# EAGLE design Analog_CAN_Board (EAGLE 8.4.3)
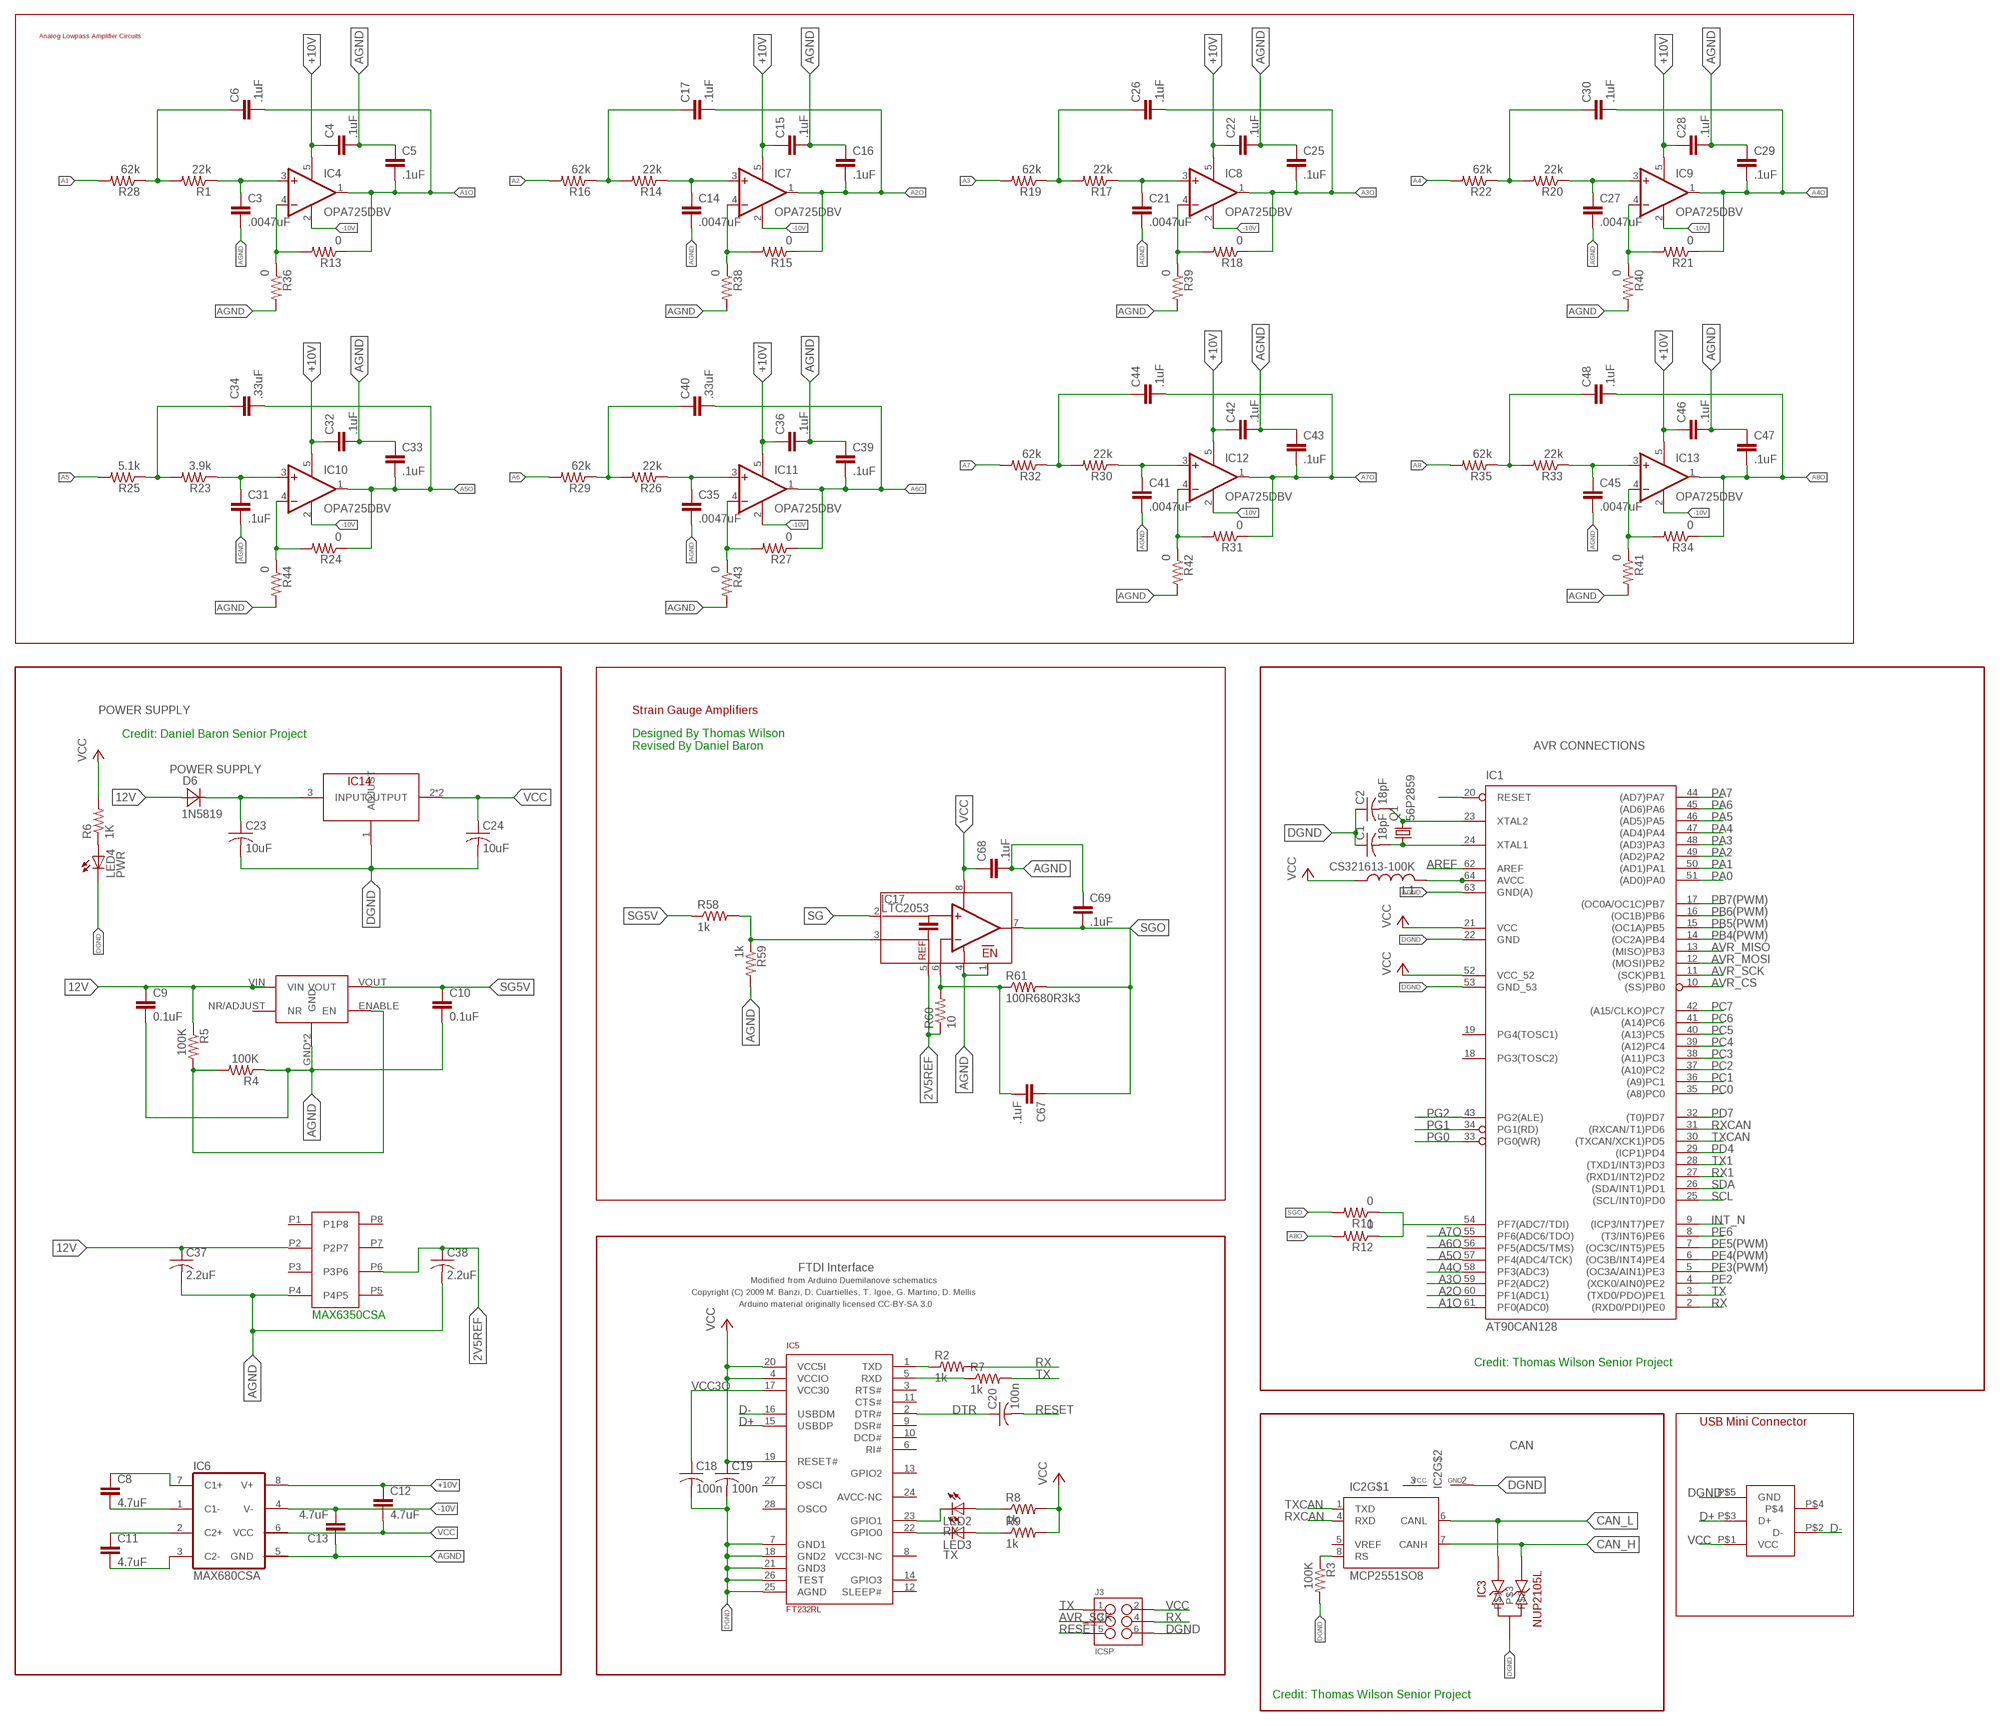
[diagram p0: schematic, sheet 1, part 1 of 2]
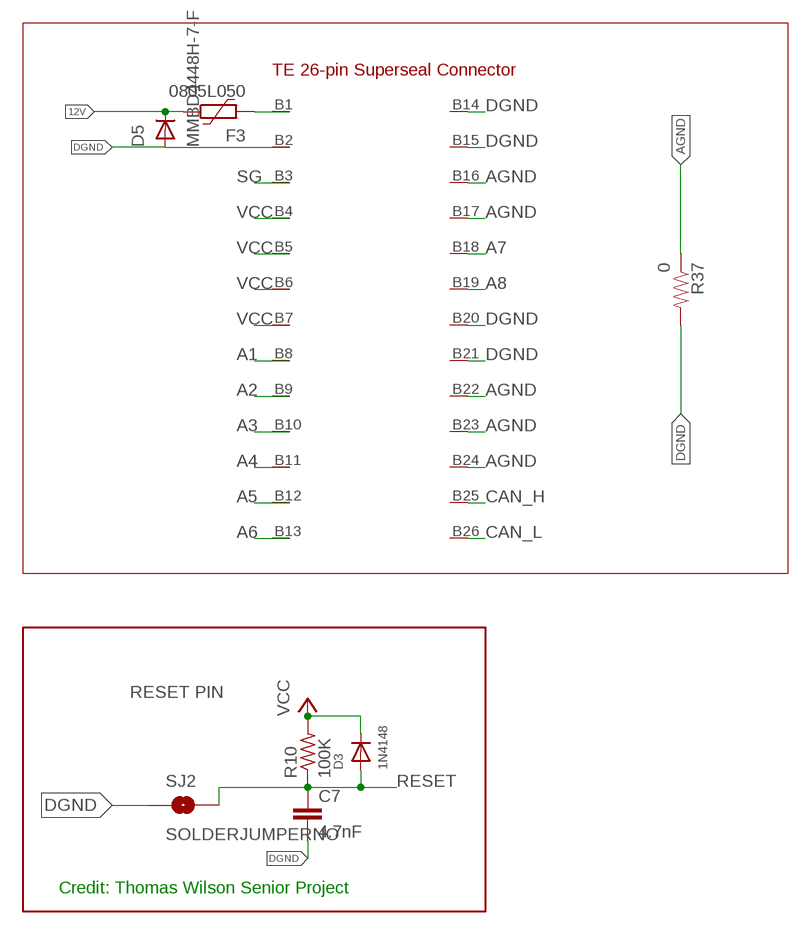
[diagram p1: schematic, sheet 1, part 2 of 2]

## Parts
C1  18pF  C-USC0805  [C0805]
C2  18pF  C-USC0805  [C0805]
C3  .0047uF  CAP0603-CAP  [0603-CAP]
C4  .1uF  CAP0603-CAP  [0603-CAP]
C5  .1uF  CAP0603-CAP  [0603-CAP]
C6  .1uF  CAP0603-CAP  [0603-CAP]
C7  4.7nF  CAP0603-CAP  [0603-CAP]
C8  4.7uF  CAP0603-CAP  [0603-CAP]
C9  0.1uF  C-EUC0603  [C0603]
C10  0.1uF  C-EUC0603  [C0603]
C11  4.7uF  CAP0603-CAP  [0603-CAP]
C12  4.7uF  CAP0603-CAP  [0603-CAP]
C13  4.7uF  CAP0603-CAP  [0603-CAP]
C14  .0047uF  CAP0603-CAP  [0603-CAP]
C15  .1uF  CAP0603-CAP  [0603-CAP]
C16  .1uF  CAP0603-CAP  [0603-CAP]
C17  .1uF  CAP0603-CAP  [0603-CAP]
C18  100n  C-USC0805  [C0805]
C19  100n  C-USC0805  [C0805]
C20  100n  C-USC0805  [C0805]
C21  .0047uF  CAP0603-CAP  [0603-CAP]
C22  .1uF  CAP0603-CAP  [0603-CAP]
C23  10uF  C-USC0603  [C0603]
C24  10uF  C-USC0603  [C0603]
C25  .1uF  CAP0603-CAP  [0603-CAP]
C26  .1uF  CAP0603-CAP  [0603-CAP]
C27  .0047uF  CAP0603-CAP  [0603-CAP]
C28  .1uF  CAP0603-CAP  [0603-CAP]
C29  .1uF  CAP0603-CAP  [0603-CAP]
C30  .1uF  CAP0603-CAP  [0603-CAP]
C31  .1uF  CAP0603-CAP  [0603-CAP]
C32  .1uF  CAP0603-CAP  [0603-CAP]
C33  .1uF  CAP0603-CAP  [0603-CAP]
C34  .33uF  CAP0603-CAP  [0603-CAP]
C35  .0047uF  CAP0603-CAP  [0603-CAP]
C36  .1uF  CAP0603-CAP  [0603-CAP]
C37  2.2uF  C-USC0603  [C0603]
C38  2.2uF  C-USC0603  [C0603]
C39  .1uF  CAP0603-CAP  [0603-CAP]
C40  .33uF  CAP0603-CAP  [0603-CAP]
C41  .0047uF  CAP0603-CAP  [0603-CAP]
C42  .1uF  CAP0603-CAP  [0603-CAP]
C43  .1uF  CAP0603-CAP  [0603-CAP]
C44  .1uF  CAP0603-CAP  [0603-CAP]
C45  .0047uF  CAP0603-CAP  [0603-CAP]
C46  .1uF  CAP0603-CAP  [0603-CAP]
C47  .1uF  CAP0603-CAP  [0603-CAP]
C48  .1uF  CAP0603-CAP  [0603-CAP]
C67  .1uF  CAP0603-CAP  [0603-CAP]
C68  .1uF  CAP0603-CAP  [0603-CAP]
C69  .1uF  CAP0603-CAP  [0603-CAP]
D3  1N4148  DIODESOD-123  [SOD-123]
D5  MMBD4448H-7-F  [SOT23-3]
D6  1N5819  [1N5819SM]
F3  0805L050  [0805L]
IC1  AT90CAN128  [TQFP64]
IC2  MCP2551SO8  [SO08]
IC3  NUP2105L  [SOT-23]
IC4  OPA725DBV  [SOT23-5]
IC5  FT232RL  [SSOP28]
IC6  MAX680CSA  [SO08]
IC7  OPA725DBV  [SOT23-5]
IC8  OPA725DBV  [SOT23-5]
IC9  OPA725DBV  [SOT23-5]
IC10  OPA725DBV  [SOT23-5]
IC11  OPA725DBV  [SOT23-5]
IC12  OPA725DBV  [SOT23-5]
IC13  OPA725DBV  [SOT23-5]
IC14  NCP1117  [SOT-223-4]
IC15  IC15  REG-104GA-5  [REG104GA-5]
IC16  MAX6350CSA  [8-SOIC]
IC17  LTC2053  [MSOP8]
J1  1734753-1_MINIUSB_CON  [1734753-1_MINIUSB_CON]
J2  SUPERSEAL1.0_26POS  [SUPERSEAL1.0_26POS]
J3  ICSP  M03X2SMD_FCI  [2X3_SMD_FCI_54202-G30]
L1  CS321613-100K  L-USL3216C  [L3216C]
LED2  RX  LEDCHIPLED_0805  [CHIPLED_0805]
LED3  TX  LEDCHIPLED_0805  [CHIPLED_0805]
LED4  PWR  LEDCHIPLED_0805  [CHIPLED_0805]
Q1  56P2859  CRYSTALSMD  [HC49UP]
R1  22k  RESISTOR0603  [0603-RES]
R2  1k  R-US_R0805  [R0805]
R3  100K  R-US_R0805  [R0805]
R4  100K  R-US_M0805  [M0805]
R5  100K  R-US_M0805  [M0805]
R6  1K  R-US_R0805  [R0805]
R7  1k  R-US_R0805  [R0805]
R8  1k  R-US_R0805  [R0805]
R9  1k  R-US_R0805  [R0805]
R10  100K  R-US_R0805  [R0805]
R11  0  RESISTOR0603  [0603-RES]
R12  0  RESISTOR0603  [0603-RES]
R13  0  RESISTOR0603  [0603-RES]
R14  22k  RESISTOR0603  [0603-RES]
R15  0  RESISTOR0603  [0603-RES]
R16  62k  RESISTOR0603  [0603-RES]
R17  22k  RESISTOR0603  [0603-RES]
R18  0  RESISTOR0603  [0603-RES]
R19  62k  RESISTOR0603  [0603-RES]
R20  22k  RESISTOR0603  [0603-RES]
R21  0  RESISTOR0603  [0603-RES]
R22  62k  RESISTOR0603  [0603-RES]
R23  3.9k  RESISTOR0603  [0603-RES]
R24  0  RESISTOR0603  [0603-RES]
R25  5.1k  RESISTOR0603  [0603-RES]
R26  22k  RESISTOR0603  [0603-RES]
R27  0  RESISTOR0603  [0603-RES]
R28  62k  RESISTOR0603  [0603-RES]
R29  62k  RESISTOR0603  [0603-RES]
R30  22k  RESISTOR0603  [0603-RES]
R31  0  RESISTOR0603  [0603-RES]
R32  62k  RESISTOR0603  [0603-RES]
R33  22k  RESISTOR0603  [0603-RES]
R34  0  RESISTOR0603  [0603-RES]
R35  62k  RESISTOR0603  [0603-RES]
R36  0  RESISTOR0603  [0603-RES]
R37  0  RESISTOR0603  [0603-RES]
R38  0  RESISTOR0603  [0603-RES]
R39  0  RESISTOR0603  [0603-RES]
R40  0  RESISTOR0603  [0603-RES]
R41  0  RESISTOR0603  [0603-RES]
R42  0  RESISTOR0603  [0603-RES]
R43  0  RESISTOR0603  [0603-RES]
R44  0  RESISTOR0603  [0603-RES]
R58  1k  RESISTOR0603  [0603-RES]
R59  1k  RESISTOR0603  [0603-RES]
R60  10  RESISTOR0603  [0603-RES]
R61  100R680R3k3  RESISTOR0603  [0603-RES]
SJ2  SOLDERJUMPERNO  [SJ_2S-NO]

## Nets
2V5REF: C38.1 IC16.P6 IC17.5(REF) R60.1
5V_REG_IN: C23.1 D6.P$2(C) IC14.3(INPUT)
12V: C9.1 C37.1 D5.3(C) D6.P$1(A) F3.1 IC15.VIN IC16.P2 R5.1
+10V: C4.1 C12.1 C15.1 C22.1 C28.1 C32.1 C36.1 C42.1 C46.1 IC4.5(V+) IC6.8(V+) IC7.5(V+) IC8.5(V+) IC9.5(V+) IC10.5(V+) IC11.5(V+) IC12.5(V+) IC13.5(V+)
-10V: C13.2 IC4.2(V-) IC6.4(V-) IC7.2(V-) IC8.2(V-) IC9.2(V-) IC10.2(V-) IC11.2(V-) IC12.2(V-) IC13.2(V-)
A1: J2.B8 R28.2
A1O: C5.2 C6.2 IC1.61(PF0(ADC0)) IC4.1(OUT) R13.1
A2: J2.B9 R16.2
A2O: C16.2 C17.2 IC1.60(PF1(ADC1)) IC7.1(OUT) R15.1
A3: J2.B10 R19.2
A3O: C25.2 C26.2 IC1.59(PF2(ADC2)) IC8.1(OUT) R18.1
A4: J2.B11 R22.2
A4O: C29.2 C30.2 IC1.58(PF3(ADC3)) IC9.1(OUT) R21.1
A5: J2.B12 R25.2
A5O: C33.2 C34.2 IC1.57(PF4(ADC4/TCK)) IC10.1(OUT) R24.1
A6: J2.B13 R29.2
A6O: C39.2 C40.2 IC1.56(PF5(ADC5/TMS)) IC11.1(OUT) R27.1
A7: J2.B18 R32.2
A7O: C43.2 C44.2 IC1.55(PF6(ADC6/TDO)) IC12.1(OUT) R31.1
A8: J2.B19 R35.2
A8O: C47.2 C48.2 IC13.1(OUT) R12.2 R34.1
AGND: C3.2 C4.2 C5.1 C9.2 C10.2 C13.1 C14.2 C15.2 C16.1 C21.2 C22.2 C25.1 C27.2 C28.2 C29.1 C31.2 C32.2 C33.1 C35.2 C36.2 C37.2 C38.2 C39.1 C41.2 C42.2 C43.1 C45.2 C46.2 C47.1 C68.2 C69.1 IC1.63(GND(A)) IC6.5(GND) IC15.GND IC15.HEATGND(GND) IC16.P4 IC17.1(EN) IC17.4(V-) J2.B16 J2.B17 J2.B22 J2.B23 J2.B24 R4.1 R36.2 R37.1 R38.2 R39.2 R40.2 R41.2 R42.2 R43.2 R44.2 R59.2
AREF: IC1.62(AREF)
AVR_CS: IC1.10((SS)PB0)
AVR_MISO: IC1.13((MISO)PB3)
AVR_MOSI: IC1.12((MOSI)PB2)
AVR_SCK: IC1.11((SCK)PB1) J3.3
CAN_H: IC2.7(CANH) IC3.2 J2.B25
CAN_L: IC2.6(CANL) IC3.1 J2.B26
D+: IC5.15(USBDP) J1.P$3(D+)
D-: IC5.16(USBDM) J1.P$2(D-)
DGND: C1.1 C2.1 C7.2 C18.2 C19.2 C23.2 C24.2 D5.1(A) IC1.22(GND) IC1.53(GND_53) IC2.2(GND) IC3.3 IC5.7(GND1) IC5.18(GND2) IC5.21(GND3) IC5.25(AGND) IC5.26(TEST) IC14.1(ADJUST) J1.P$5(GND) J2.B2 J2.B14 J2.B15 J2.B20 J2.B21 J3.6 LED4.C R3.2 R37.2 SJ2.1
DTR: C20.1 IC5.2(DTR#)
INT_N: IC1.9((ICP3/INT7)PE7)
M8RXD: IC5.1(TXD) R2.1
M8TXD: IC5.5(RXD) R7.1
N$1: F3.2 J2.B1
N$2: IC15.ENABLE(EN) R4.2 R5.2
N$5: C6.1 R1.2 R28.1
N$6: IC2.8(RS) R3.1
N$9: LED4.A R6.1
N$11: C1.2 IC1.24(XTAL1) Q1.1
N$17: C3.1 IC4.3(+IN) R1.1
N$18: IC1.54(PF7(ADC7/TDI)) R11.1 R12.1
N$19: IC4.4(-IN) R13.2 R36.1
N$20: C8.1 IC6.7(C1+)
N$21: C11.1 IC6.2(C2+)
N$22: IC1.64(AVCC) L1.2
N$23: C8.2 IC6.1(C1-)
N$24: C11.2 IC6.3(C2-)
N$25: C14.1 IC7.3(+IN) R14.1
N$26: IC7.4(-IN) R15.2 R38.1
N$27: C17.1 R14.2 R16.1
N$28: IC17.3(+IN) R58.2 R59.1
N$29: C67.2 IC17.6(RG) R60.2 R61.1
N$30: C21.1 IC8.3(+IN) R17.1
N$31: IC8.4(-IN) R18.2 R39.1
N$32: IC5.23(GPIO1) LED2.C
N$33: C26.1 R17.2 R19.1
N$34: IC5.22(GPIO0) LED3.C
N$35: LED2.A R8.1
N$36: LED3.A R9.1
N$37: C27.1 IC9.3(+IN) R20.1
N$38: IC9.4(-IN) R21.2 R40.1
N$39: C30.1 R20.2 R22.1
N$40: C31.1 IC10.3(+IN) R23.1
N$41: IC10.4(-IN) R24.2 R44.1
N$42: C34.1 R23.2 R25.1
N$43: C35.1 IC11.3(+IN) R26.1
N$44: IC11.4(-IN) R27.2 R43.1
N$45: C40.1 R26.2 R29.1
N$46: C41.1 IC12.3(+IN) R30.1
N$47: IC12.4(-IN) R31.2 R42.1
N$48: C44.1 R30.2 R32.1
N$49: C45.1 IC13.3(+IN) R33.1
N$50: IC13.4(-IN) R34.2 R41.1
N$51: C48.1 R33.2 R35.1
PA0: IC1.51((AD0)PA0)
PA1: IC1.50((AD1)PA1)
PA2: IC1.49((AD2)PA2)
PA3: IC1.48((AD3)PA3)
PA4: IC1.47((AD4)PA4)
PA5: IC1.46((AD5)PA5)
PA6: IC1.45((AD6)PA6)
PA7: IC1.44((AD7)PA7)
PB4(PWM): IC1.14((OC2A)PB4)
PB5(PWM): IC1.15((OC1A)PB5)
PB6(PWM): IC1.16((OC1B)PB6)
PB7(PWM): IC1.17((OC0A/OC1C)PB7)
PC0: IC1.35((A8)PC0)
PC1: IC1.36((A9)PC1)
PC2: IC1.37((A10)PC2)
PC3: IC1.38((A11)PC3)
PC4: IC1.39((A12)PC4)
PC5: IC1.40((A13)PC5)
PC6: IC1.41((A14)PC6)
PC7: IC1.42((A15/CLKO)PC7)
PD4: IC1.29((ICP1)PD4)
PD7: IC1.32((T0)PD7)
PE2: IC1.4((XCK0/AIN0)PE2)
PE3(PWM): IC1.5((OC3A/AIN1)PE3)
PE4(PWM): IC1.6((OC3B/INT4)PE4)
PE5(PWM): IC1.7((OC3C/INT5)PE5)
PE6: IC1.8((T3/INT6)PE6)
PG0: IC1.33(PG0(WR))
PG1: IC1.34(PG1(RD))
PG2: IC1.43(PG2(ALE))
RESET: C7.1 C20.2 D3.A IC1.20(RESET) J3.5 R10.1 SJ2.2
RX: IC1.2((RXD0/PDI)PE0) J3.4 R2.2
RX1: IC1.27((RXD1/INT2)PD2)
RXCAN: IC1.31((RXCAN/T1)PD6) IC2.4(RXD)
SCL: IC1.25((SCL/INT0)PD0)
SDA: IC1.26((SDA/INT1)PD1)
SG: IC17.2(-IN) J2.B3
SG5V: C10.1 IC15.VOUT R58.1
SGO: C67.1 C69.2 IC17.7(OUT) R11.2 R61.2
TX: IC1.3((TXD0/PDO)PE1) J3.1 R7.2
TX1: IC1.28((TXD1/INT3)PD3)
TXCAN: IC1.30((TXCAN/XCK1)PD5) IC2.1(TXD)
VCC: C12.2 C19.1 C24.1 C68.1 D3.C IC1.21(VCC) IC1.52(VCC_52) IC5.4(VCCIO) IC5.19(RESET#) IC5.20(VCC5I) IC6.6(VCC) IC14.2(OUTPUT) IC14.4(OUTPUT) IC17.8(V+) J1.P$1(VCC) J2.B4 J2.B5 J2.B6 J2.B7 J3.2 L1.1 R6.2 R8.2 R9.2 R10.2
VCC3O: C18.1 IC5.17(VCC30)
XTAL1: C2.2 IC1.23(XTAL2) Q1.2
Unconnected: IC1.18(PG3(TOSC2)) IC1.19(PG4(TOSC1)) IC2.5(VREF) IC5.3(RTS#) IC5.6(RI#) IC5.8(VCC3I-NC) IC5.9(DSR#) IC5.10(DCD#) IC5.11(CTS#) IC5.12(SLEEP#) IC5.13(GPIO2) IC5.14(GPIO3) IC5.24(AVCC-NC) IC5.27(OSCI) IC5.28(OSCO) IC15.NR/ADJUST(NR) IC16.P1 IC16.P3 IC16.P5 IC16.P7 IC16.P8 J1.P$4

## Notes on the sheet
- Analog Lowpass Amplifier Circuits
- TE 26-pin Superseal Connector
- POWER SUPPLY | Strain Gauge Amplifiers
- Credit: Daniel Baron Senior Project
- Designed By Thomas Wilson
  Revised By Daniel Baron
- AVR CONNECTIONS
- POWER SUPPLY
- RESET PIN
- Credit: Thomas Wilson Senior Project
- FTDI Interface
- Modified from Arduino Duemilanove schematics
- Copyright (C) 2009 M. Banzi, D. Cuartielles, T. Igoe, G. Martino, D. Mellis
- Arduino material originally licensed CC-BY-SA 3.0
- MAX6350CSA
- Credit: Thomas Wilson Senior Project
- USB Mini Connector
- CAN
- Credit: Thomas Wilson Senior Project

## Power pins joined to a net without a drawn wire
VCC: IC2.3(VCC)

## Library data of the parts
C1 C2 C18-C20 C23 C24 C37 C38 = rcl:C-US: CAPACITOR, American symbol
C3-C6 C8 C11-C17 C21 C22 C25-C36 C39-C48 C67-C69 = SparkFun-Passives:CAP: Capacitor Standard 0603 ceramic capacitor, and 0.1" leaded capacitor.
C7 = SparkFun-Capacitors:CAP: Capacitor Standard 0603 ceramic capacitor, and 0.1" leaded capacitor.
C9 C10 = rcl:C-EU: CAPACITOR, European symbol
D3 = adafruit:DIODE: Diode SMADIODE - SMA Surface Mount Package 20V 1A Schottky Diode Digikey: 641-1014-6-ND DO-1N4148 - Through Hole Small Current Diode SOD-123 20V 1 A (.5mV Vf) Schottky Diode - Digikey: MBRX120TPMSCT-ND SOD-323 10V 570mA (.38mV Vf, 3ns) Schottky Diode - Digikey: ZLLS410CT-ND SOD-523 30V 30mA Schottky Diode (RB751S-40TE61) - Digikey: RB751S-40TE61CT-ND SOT23-R/W - SOT23 Package (R = Solder Paste/Reflow Ovens, W = Hand-Soldering) BAT54Film 40V 300mA - Digikey: 497-7162-1-ND
D5 = diodes-inc:MMBD4448H-7-F
D6 = diode:1N5819
F3 = LittleFuse:?: Polyfuse Resettable PTC Source: http://www.littelfuse.com/products/resettable-ptcs.aspx; MF: Littelfuse; MPN: 0805L050; OC_FARNELL: 1832103; OC_NEWARK: 18M4776
IC1 = at90can128:AT90CAN128
IC2 = can:MCP2551: CAN Tranceiver Microchip
IC3 = Artificial Science:NUP2105L
IC4 IC7-IC13 = linear:OPA725: Very Low Noise, High-Speed, 12V CMOS Operational Amplifier Source: http://focus.ti.com/lit/ds/symlink/opa725.pdf
IC5 = SmartPrj:FT232RL
IC6 = maxim:MAX680CSA: Switched-capcitor VOLTAGE CONVERTER; MF: MAXIM; MPN: MAX680CSA; OC_FARNELL: 9725717; OC_NEWARK: 34C3975
IC14 = on-semiconductor:NCP1117
IC15 = DashAndCAN library:REG-104GA-5
IC16 = DashAndCAN library:MAX6350CSA
IC17 = linear-technology:LTC2053: DK: LTC2053CMS8#PBF-ND
J1 = us-te-con:1734753-1_MINIUSB_CON
J2 = TE:SUPERSEAL1.0_26POS
J3 = SparkFun-Connectors:M03X2: 2x3 .1" header. Shrouded, with keying- CONN-10681 SMT- CONN-11415 Pogo pins- HW-11044
L1 = rcl:L-US: INDUCTOR, American symbol
LED2-LED4 = led:LED: LED OSRAM: - CHIPLED LG R971, LG N971, LY N971, LG Q971, LY Q971, LO R971, LY R971 LH N974, LH R974 LS Q976, LO Q976, LY Q976 LO Q996 - Hyper CHIPLED LW Q18S LB Q993, LB Q99A, LB R99A - SideLED LS A670, LO A670, LY A670, LG A670, LP A670 LB A673, LV A673, LT A673, LW A673 LH A674 LY A675 LS A676, LA A676, LO A676, LY A676, LW A676 LS A679, LY A679, LG A679 - Hyper Micro SIDELED® LS Y876, LA Y876, LO Y876, LY Y876 LT Y87S - SmartLED LW L88C, LW L88S LB L89C, LB L89S, LG L890 LS L89K, LO L89K, LY L89K LS L896, LA L896, LO L896, LY L896 - TOPLED LS T670, LO T670, LY T670, LG T670, LP T670 LSG T670, LSP T670, LSY T670, LOP T670, LYG T670 LG T671, LOG T671, LSG T671 LB T673, LV T673, LT T673, LW T673 LH T674 LS T676, LA T676, LO T676, LY T676, LB T676, LH T676, LSB T676, LW T676 LB T67C, LV T67C, LT T67C, LS T67K, LO T67K, LY T67K, LW E67C LS E67B, LA E67B, LO E67B, LY E67B, LB E67C, LV E67C, LT E67C LW T67C LS T679, LY T679, LG T679 LS T770, LO T770, LY T770, LG T770, LP T770 LB T773, LV T773, LT T773, LW T773 LH T774 LS E675, LA E675, LY E675, LS T675 LS T776, LA T776, LO T776, LY T776, LB T776 LHGB T686 LT T68C, LB T68C - Hyper Mini TOPLED® LB M676 - Mini TOPLED Santana® LG M470 LS M47K, LO M47K, LY M47K Source: http://www.osram.convergy.de LUXEON: - LUMILED® LXK2-PW12-R00, LXK2-PW12-S00, LXK2-PW14-U00, LXK2-PW14-V00 LXK2-PM12-R00, LXK2-PM12-S00, LXK2-PM14-U00 LXK2-PE12-Q00, LXK2-PE12-R00, LXK2-PE12-S00, LXK2-PE14-T00, LXK2-PE14-U00 LXK2-PB12-K00, LXK2-PB12-L00, LXK2-PB12-M00, LXK2-PB14-N00, LXK2-PB14-P00, LXK2-PB14-Q00 LXK2-PR12-L00, LXK2-PR12-M00, LXK2-PR14-Q00, LXK2-PR14-R00 LXK2-PD12-Q00, LXK2-PD12-R00, LXK2-PD12-S00 LXK2-PH12-R00, LXK2-PH12-S00 LXK2-PL12-P00, LXK2-PL12-Q00, LXK2-PL12-R00 Source: www.luxeon.com KINGBRIGHT: KA-3528ASYC Source: www.kingbright.com
Q1 = SparkFun-FreqCtrl:CRYSTAL: Various standard crystals. Proven footprints. Spark Fun Electronics SKU : COM-00534
R1 R11-R44 R58-R61 = SparkFun-Resistors:RESISTOR: Resistor Basic schematic elements and footprints for 0603, 1206, and PTH resistors.
R2-R10 = rcl:R-US_: RESISTOR, American symbol
SJ2 = SparkFun-Passives:SOLDERJUMPER: Solder Jumper Standard SMD solder jumper. Used to automate production. Two varients : Normally Open and Normally Closed are the same, but have different paste layers. NC will have a large amount of paste and should jumper during reflow.

## Board
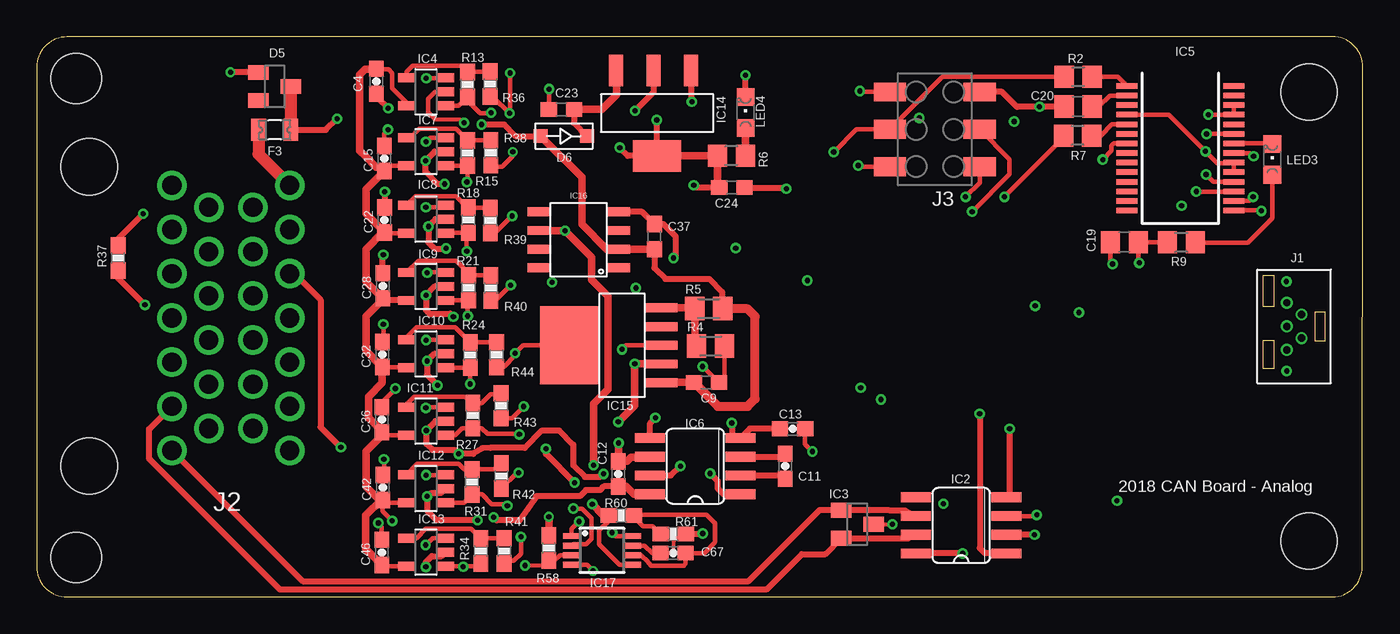
[diagram p2: board, top side]
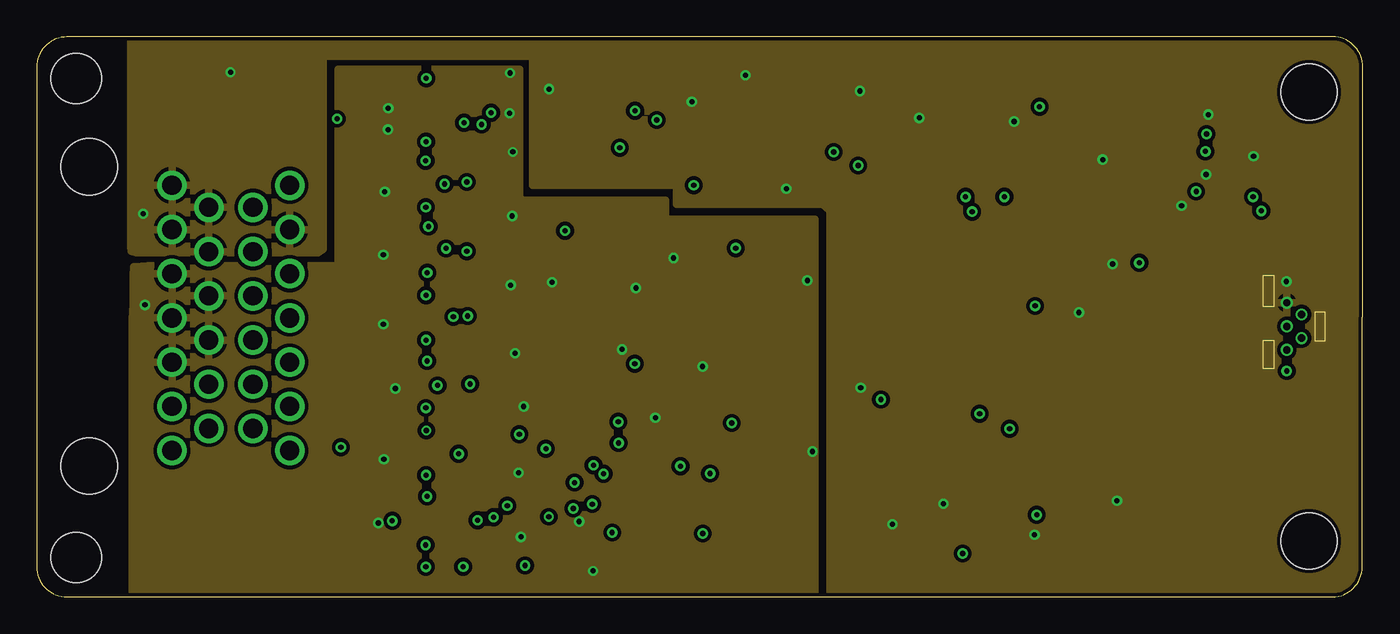
[diagram p3: board, inner layer TopMiddle]
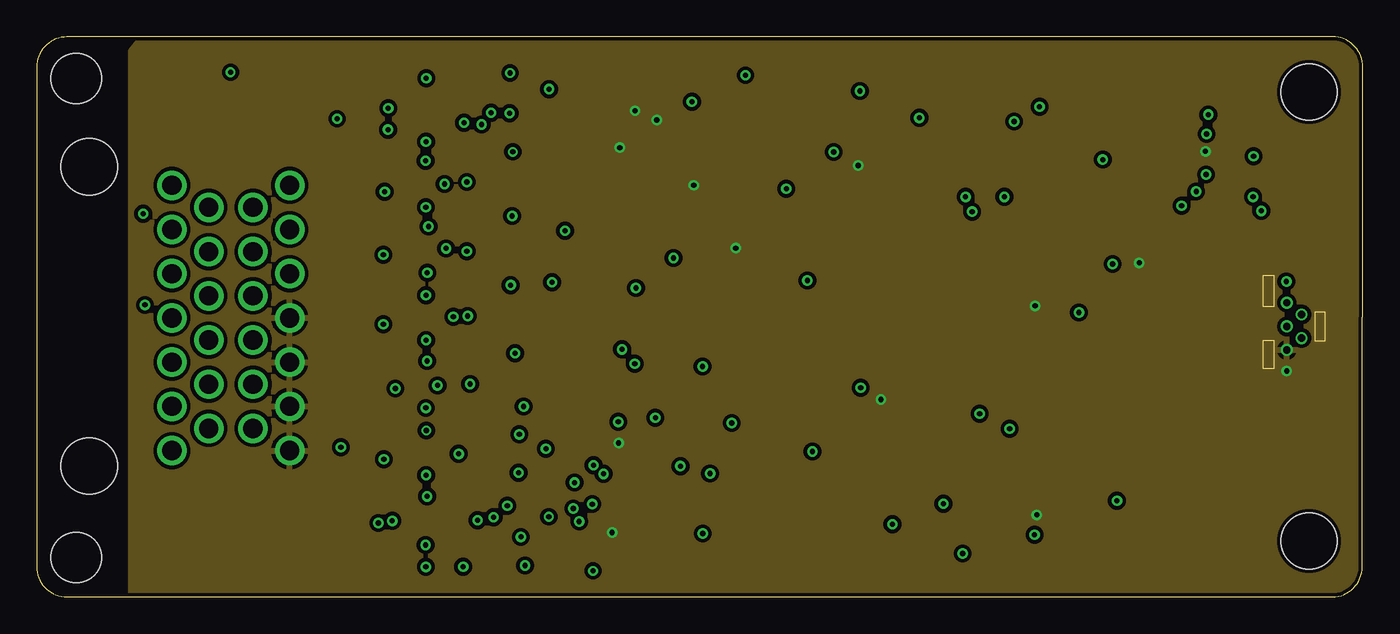
[diagram p4: board, inner layer BottomMiddle]
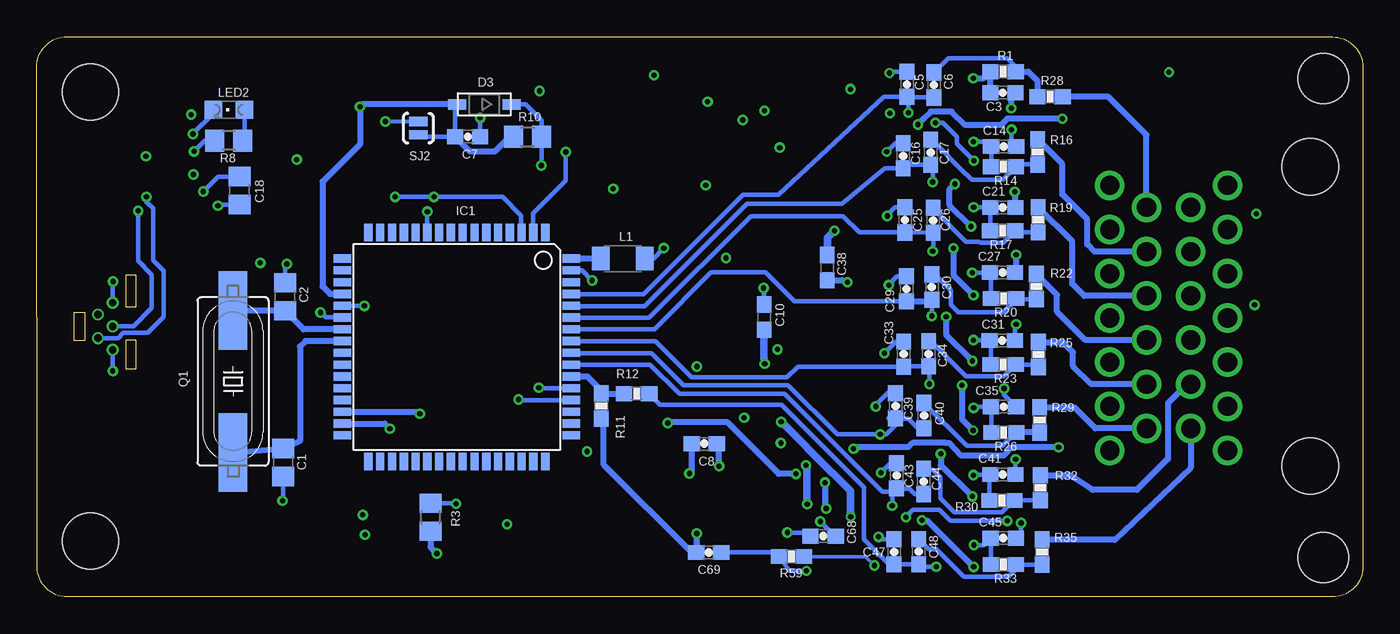
[diagram p5: board, bottom side, seen from below]

Size 90.01 x 38.01 mm. Coordinates in mm from the lower left corner, seen from the top.
Outline: 0,35.97 0,2.03 arc90 2.03,0 87.95,0 arc90 89.98,2.03 90.01,35.98 arc90 87.98,38.01 2.03,38 arc90 0,35.97
Copper layers (1*6*11*16): Top 0.053340625mm / dielectric 7.5mil / TopMiddle 0.035559375mm / dielectric 40mil / BottomMiddle 0.035559375mm / dielectric 7.5mil / Bottom 0.053340625mm
Design rules "default *": minimum track width 10mil, minimum drill 6mil, track to track 6mil, track to pad 0.152653125mm, pad to pad 6mil, via to via 6mil, smd to smd 6mil, copper to edge 10mil, drill to drill 6mil, minimum pad ring 6mil, minimum via ring 6mil, stop-mask expansion 4mil, vias tented up to drill 0mil, thermal gap 10mil
Holes 3.81 mm at 3.56,29.2 3.56,8.88 86.36,34.28 86.36,3.8

### Footprints (pad centres in the part's own frame; a part is rotated, then mirrored left to right if it is on the bottom)
C0805 = smd 1.3 x 1.5: 1 -0.95,0; 2 0.95,0
0603-CAP = smd 1.1 x 1: 1 -0.85,0; 2 0.85,0
C0603 = smd 1.1 x 1: 1 -0.85,0; 2 0.85,0
SOD-123 = smd 1.2 x 0.7: A 1.85,0; C -1.85,0
SOT23-3 = smd 1 x 1.4: 1 -0.95,-1.1; 2 0.95,-1.1; 3 0,1.1
1N5819SM = smd 0.95 x 0.9: P$1 -1.575,0; P$2 1.575,0
0805L = smd 1 x 1.5: 1 -1.1,0; 2 1.1,0
TQFP64 = smd 1.194 x 0.559: 1 -7.76,6; 2 -7.76,5.2; 3 -7.76,4.4; 4 -7.76,3.6; 5 -7.76,2.8; 6 -7.76,2; 7 -7.76,1.2; 8 -7.76,0.4; 9 -7.76,-0.4; 10 -7.76,-1.2; 11 -7.76,-2; 12 -7.76,-2.8; 13 -7.76,-3.6; 14 -7.76,-4.4; 15 -7.76,-5.2; 16 -7.76,-6; 33 7.76,-6; 34 7.76,-5.2; 35 7.76,-4.4; 36 7.76,-3.6; 37 7.76,-2.8; 38 7.76,-2; 39 7.76,-1.2; 40 7.76,-0.4; 41 7.76,0.4; 42 7.76,1.2; 43 7.76,2; 44 7.76,2.8; 45 7.76,3.6; 46 7.76,4.4; 47 7.76,5.2; 48 7.76,6 | smd 0.559 x 1.194: 17 -6,-7.76; 18 -5.2,-7.76; 19 -4.4,-7.76; 20 -3.6,-7.76; 21 -2.8,-7.76; 22 -2,-7.76; 23 -1.2,-7.76; 24 -0.4,-7.76; 25 0.4,-7.76; 26 1.2,-7.76; 27 2,-7.76; 28 2.8,-7.76; 29 3.6,-7.76; 30 4.4,-7.76; 31 5.2,-7.76; 32 6,-7.76; 49 6,7.76; 50 5.2,7.76; 51 4.4,7.76; 52 3.6,7.76; 53 2.8,7.76; 54 2,7.76; 55 1.2,7.76; 56 0.4,7.76; 57 -0.4,7.76; 58 -1.2,7.76; 59 -2,7.76; 60 -2.8,7.76; 61 -3.6,7.76; 62 -4.4,7.76; 63 -5.2,7.76; 64 -6,7.76
SO08 = smd 0.66 x 2.032: 1 -1.905,-3.073; 2 -0.635,-3.073; 3 0.635,-3.073; 4 1.905,-3.073; 5 1.905,3.073; 6 0.635,3.073; 7 -0.635,3.073; 8 -1.905,3.073
SOT-23 = smd 1 x 1.4: 1 -0.95,-1.1; 2 0.95,-1.1; 3 0,1.1
SOT23-5 = smd 0.6 x 1.2: 1 -0.95,-1.306; 2 0,-1.306; 3 0.95,-1.306; 4 0.95,1.306; 5 -0.95,1.306
SSOP28 = smd 0.381 x 1.499: 1 -4.225,-3.625; 2 -3.575,-3.625; 3 -2.925,-3.625; 4 -2.275,-3.625; 5 -1.625,-3.625; 6 -0.975,-3.625; 7 -0.325,-3.625; 8 0.325,-3.625; 9 0.975,-3.625; 10 1.625,-3.625; 11 2.275,-3.625; 12 2.925,-3.625; 13 3.575,-3.625; 14 4.225,-3.625; 15 4.225,3.625; 16 3.575,3.625; 17 2.925,3.625; 18 2.275,3.625; 19 1.625,3.625; 20 0.975,3.625; 21 0.325,3.625; 22 -0.325,3.625; 23 -0.975,3.625; 24 -1.625,3.625; 25 -2.275,3.625; 26 -2.925,3.625; 27 -3.575,3.625; 28 -4.225,3.625
SOT-223-4 = smd 0.95 x 2.15: 1 -2.3,-2.9; 2 0.24,-2.9; 3 2.78,-2.9 | smd 3.25 x 2.15: 4 0,2.9
REG104GA-5 = smd 0.6 x 2.2: ENABLE 2.54,-6.2; GND 0,-6.2; NR/ADJUST 1.27,-6.2; VIN -2.54,-6.2; VOUT -1.27,-6.2 | smd 5.3 x 4: HEATGND 0,0
8-SOIC = smd 0.6 x 1.55: P1 -1.905,-2.7; P2 -0.635,-2.7; P3 0.635,-2.7; P4 1.905,-2.7; P5 1.905,2.7; P6 0.635,2.7; P7 -0.635,2.7; P8 -1.905,2.7
MSOP8 = smd 0.4 x 1.2: 1 -0.975,-2.05; 2 -0.325,-2.05; 3 0.325,-2.05; 4 0.975,-2.05; 5 0.975,2.05; 6 0.325,2.05; 7 -0.325,2.05; 8 -0.975,2.05
1734753-1_MINIUSB_CON = drill 0.5: P$1 -0.5,-1.6; P$2 0.5,-0.8; P$3 -0.5,0; P$4 0.5,0.8; P$5 -0.5,1.6
SUPERSEAL1.0_26POS = drill 1.3 pad 2: B1 -9.17,4.73; B2 -6.17,4.73; B3 -3.17,4.73; B4 -0.17,4.73; B5 2.83,4.73; B6 5.83,4.73; B7 8.83,4.73; B8 -7.67,2.23; B9 -4.67,2.23; B10 -1.67,2.23; B11 1.33,2.23; B12 4.33,2.23; B13 7.33,2.23; B14 -7.67,-0.77; B15 -4.67,-0.77; B16 -1.67,-0.77; B17 1.33,-0.77; B18 4.33,-0.77; B19 7.33,-0.77; B20 -9.17,-3.27; B21 -6.17,-3.27; B22 -3.17,-3.27; B23 -0.17,-3.27; B24 2.83,-3.27; B25 5.83,-3.27; B26 8.83,-3.27 | hole 3.4: -16.42,-9.77; 16.08,-9.77
2X3_SMD_FCI_54202-G30 = smd 1.27 x 2.18: 1 -2.54,-3.05; 2 -2.54,3.05; 3 0,-3.05; 4 0,3.05; 5 2.54,-3.05; 6 2.54,3.05
L3216C = smd 1.2 x 1.6: 1 -1.5,0; 2 1.5,0
CHIPLED_0805 = smd 1.2 x 1.2: A 0,-1.05; C 0,1.05
HC49UP = smd 5.334 x 1.93: 1 -4.826,0; 2 4.826,0
0603-RES = smd 1.1 x 1: 1 -0.85,0; 2 0.85,0
R0805 = smd 1.3 x 1.5: 1 -0.95,0; 2 0.95,0
M0805 = smd 1.3 x 1.6: 1 -0.95,0; 2 0.95,0
SJ_2S-NO = smd 0.635 x 1.27: 1 -0.45,0; 2 0.45,0

### Placement (x,y rotation side)
C1  73.28,9.12 90 bottom
C2  73.16,20.38 270 bottom
C3  24.43,34.21 0 bottom
C4  23.04,34.99 270 top
C5  30.94,34.79 270 bottom
C6  29.11,34.74 270 bottom
C7  60.76,31.23 0 bottom
C8  44.7,10.4 180 bottom
C9  45.46,14.56 0 top
C10  40.63,18.99 90 bottom
C11  50.8,8.88 90 top
C12  39.48,8.35 90 top
C13  51.31,11.42 180 top
C14  24.38,30.56 0 bottom
C15  23.59,29.75 90 top
C16  31.19,29.94 270 bottom
C17  29.32,30.17 270 bottom
C18  76.25,27.58 270 bottom
C19  73.84,24.08 180 top
C20  70.69,33.28 180 top
C21  24.43,26.44 0 bottom
C22  23.61,25.58 90 top
C23  35.61,33.08 180 top
C24  47.18,27.79 0 top
C25  31.08,25.59 270 bottom
C26  29.16,25.56 270 bottom
C27  24.46,22.02 0 bottom
C28  23.48,21.11 90 top
C29  30.97,20.91 270 bottom
C30  29.25,21.02 270 bottom
C31  24.47,17.41 0 bottom
C32  23.45,16.45 90 top
C33  31.16,16.48 270 bottom
C34  29.46,16.5 270 bottom
C35  24.38,12.91 0 bottom
C36  23.43,12.03 90 top
C37  41.93,24.45 90 top
C38  36.35,22.35 270 bottom
C39  31.71,12.97 270 bottom
C40  29.78,12.3 270 bottom
C41  24.43,8.3 0 bottom
C42  23.48,7.43 90 top
C43  31.65,8.23 270 bottom
C44  29.81,7.84 270 bottom
C45  24.4,3.99 0 bottom
C46  23.42,3.02 90 top
C47  31.81,3.06 270 bottom
C48  30.14,3.07 270 bottom
C67  43.2,2.98 0 top
C68  36.63,4.12 0 bottom
C69  44.4,3.02 180 bottom
D3  59.63,33.43 180 bottom
D5  16.15,34.64 270 top
D6  35.78,31.28 0 top
F3  16.15,31.69 180 top
IC1  61.5,16.96 270 bottom
IC2  62.75,4.85 90 top
IC3  55.71,4.94 270 top
IC4  26.42,34.28 90 top
IC5  77.63,30.45 270 top
IC6  44.7,8.88 90 top
IC7  26.42,30.21 90 top
IC8  26.42,25.64 90 top
IC9  26.42,21.07 90 top
IC10  26.42,16.5 90 top
IC11  26.42,11.92 90 top
IC12  26.42,7.35 90 top
IC13  26.42,3.03 90 top
IC14  42.11,32.83 180 top
IC15  36.18,17.07 90 top
IC16  36.78,24.23 90 top
IC17  38.36,3.16 270 top
J1  85.36,18.36 0 top
J2  12.44,18.76 270 top
J3  60.96,31.74 90 top
L1  50.23,22.96 180 bottom
LED2  76.96,33.06 90 bottom
LED3  83.88,29.7 0 top
LED4  48.12,32.88 0 top
Q1  76.69,14.62 90 bottom
R1  24.41,35.65 0 bottom
R2  70.69,35.29 180 top
R3  63.28,5.41 90 bottom
R4  45.74,17.03 180 top
R5  45.62,19.58 180 top
R6  47.15,29.94 180 top
R7  70.66,31.31 180 top
R8  76.97,30.97 180 bottom
R9  77.7,24.06 180 top
R10  56.69,31.23 0 bottom
R11  51.69,12.95 270 bottom
R12  49.29,13.8 0 bottom
R13  29.24,34.77 90 top
R14  24.38,29.2 0 bottom
R15  29.25,30.13 90 top
R16  22.06,30.2 90 bottom
R17  24.44,24.84 0 bottom
R18  29.29,25.57 90 top
R19  22.04,25.6 90 bottom
R20  24.38,20.26 0 bottom
R21  29.32,20.98 90 top
R22  22.16,21.06 90 bottom
R23  24.4,15.77 0 bottom
R24  29.42,16.42 90 top
R25  22.01,16.46 90 bottom
R26  24.36,11.15 0 bottom
R27  29.6,12.3 90 top
R28  21.23,33.95 0 bottom
R29  21.93,12.01 90 bottom
R30  24.49,6.55 0 bottom
R31  29.55,7.8 90 top
R32  21.88,7.41 90 bottom
R33  24.39,2.2 0 bottom
R34  30.14,3.12 90 top
R35  21.75,3.05 90 bottom
R36  30.77,34.81 270 top
R37  5.52,23 90 top
R38  30.82,30.14 270 top
R39  30.78,25.55 270 top
R40  30.82,20.97 270 top
R41  31.72,3.12 270 top
R42  31.53,8.22 270 top
R43  31.52,12.98 270 top
R44  31.2,16.43 270 top
R58  34.75,3.33 270 top
R59  38.78,2.75 180 bottom
R60  39.68,5.53 0 top
R61  43.2,4.27 0 top
SJ2  64.11,31.82 270 bottom

### Tracks (layer width: path | path; a pad name or v marks a point on that pad's centre or on a via)
2V5REF  (via drill 0.35 pad 0.7)
  Top 0.305: R60.1 38.83,5.18 38.18,4.54 38.18,3.59 39.57,2.2 40.4,2.2 IC17.5
  Top 0.508: IC16.P6 34.1,24.85 v35.86,24.85 37.67,23.05 37.67,21.51 38.78,20.4 38.78,14.1 37.87,13.19 37.86,13.19 37.78,13.11 v37.78,8.95 v37.79,8.94 | R60.1 38.83,5.59 38.42,5.59 v37.71,6.3
  Bottom 0.508: C38.1 36.35,24.37 v35.86,24.85 | v37.71,6.3 37.71,8.86 v37.79,8.94
5V_REG_IN
  Top 0.406: C23.1 36.46,32.17 D6.P$2
  Top 0.508: C23.1 38.38,33.08 39.36,34.06 39.36,35.73 IC14.3
12V  (via drill 0.35, 0.35 pad 0.7)
  Top 0.406: C37.1 41.93,22.32 42.67,21.58 45.66,21.58 46.53,20.7 46.53,19.62 R5.1 | F3.1 19.62,31.69 v20.38,32.45 | v30.19,32.06 31.73,32.06 32.51,31.28 D6.P$1
  Top 0.508: C37.1 IC16.P2 38.69,23.6 37.01,25.28 37.01,28.47 D6.P$1 | C9.1 42.4,14.55 IC15.VIN
  Top 0.61: C9.1 46.23,12.94 48.26,12.94 48.77,13.45 48.77,19.04 48.26,19.54 46.6,19.54 R5.1
  Top 0.813: D5.3 17.25,31.7 F3.1
  Bottom 0.406: v20.38,32.45 24.13,32.45 24.57,32.01 26.98,32.01 27.91,32.94 29.32,32.94 29.77,32.48 v30.19,32.06
+10V  (via drill 0.35 pad 0.7)
  Top 0.305: IC7.5 23.63,29.26 C15.1 | IC8.5 23.65,24.69 C22.1 | C32.1 25.05,15.6 IC10.5 | IC11.5 23.63,10.97 C36.1 | IC12.5 23.47,6.4 23.37,6.46 | IC13.5 23.51,2.08 C46.1 | C42.1 23.48,5.81 v24.13,5.16 | 39.09,7.49 C12.1 | IC4.5 25.11,33.55 24.13,34.53 24.13,35.55 23.88,35.8 23.09,35.8 C4.1
  Top 0.406: IC9.5 23.63,20.12 C28.1 | C12.1 38.49,7.5 38.24,7.25 37.28,7.25 36.87,6.84 33.91,6.84 32.77,5.19 31.23,5.19 v31.01,5.41
  Top 0.508: C46.1 22.33,3.27 22.33,5.55 23.36,6.58 C42.1 23.37,6.46 22.35,7.48 22.35,9.89 23.43,10.96 C36.1 23.43,11.25 22.52,12.16 22.52,13.6 23.45,14.53 C32.1 22.35,16.7 22.35,19.04 23.48,20.17 C28.1 22.35,21.39 22.35,23.61 23.48,24.73 C22.1 22.35,25.99 22.35,27.67 23.61,28.93 C15.1 23.44,29.16 23.05,29.16 22.35,29.86 22.34,29.86 21.91,30.29 21.91,35.44 22.27,35.8 22.99,35.8 C4.1 | C12.1 40.01,7.5 40.53,6.98 IC6.8
  Bottom 0.305: v24.13,5.16 27.99,5.16 28.73,5.9 30.52,5.9 v31.01,5.41
-10V  (via drill 0.35, 0.35 pad 0.7)
  Top 0.305: IC4.2 27.03,34.28 26.55,33.79 26.55,32.88 27.03,32.4 28.73,32.4 v29,32.17
  Top 0.406: C13.2 48.41,11.42 IC6.4 47.75,10.75 47.12,10.75 47.18,10.81 v47.18,11.8 | IC11.2 27.06,11.92 26.77,11.63 26.77,11.62 v26.44,11.29 26.44,10.39 26.86,9.97 28.38,9.97 v28.64,9.71 29.63,9.71 30.27,10.09 30.24,10.09 30.77,10.12 33.14,10.12 34.31,11.3 35.45,11.3 36.41,10.34 36.41,8.93 37.2,8.14 38.26,8.14 v38.47,8.35 | IC12.2 27.43,7.06 26.77,7.06 26.65,6.94 v26.5,6.82 26.5,5.84 27.1,5.24 29.92,5.24 v29.92,5.2 | IC10.2 26.97,16.5 v26.49,16.01 26.49,15.07 v27.2,14.36 | IC9.2 27.02,21.07 v26.42,20.47 26.42,19.47 26.66,19.23 28.06,19.23 v28.28,19.01 | IC8.2 27.06,25.64 26.77,25.35 26.77,25.32 v26.59,25.14 26.59,24.05 27.01,23.63 27.76,23.63 v27.78,23.65 | v27.68,28.02 27.22,28.02 26.39,28.85 v26.39,29.6 27,30.21 IC7.2 | v26.41,2.04 26.41,2.38 26.77,2.74 26.78,2.74 26.82,2.78 27.46,2.78 IC13.2
  Bottom 0.305: v29,32.17 28.49,32.18 27.53,31.23 27.53,30.74 v26.39,29.6
  Bottom 0.406: v27.2,14.36 27.2,12.05 v26.44,11.29 | v28.28,19.01 28.28,17.8 v26.49,16.01 | v26.59,25.14 v26.6,25.14 28.04,26.58 28.04,27.66 v27.68,28.02 | v27.78,23.65 27.78,21.83 v26.42,20.47 | v29.92,5.2 29.59,5.2 v26.41,2.04 | v28.64,9.71 28.64,8.95 v26.5,6.82 | v38.47,8.35 39.63,8.35 43.12,11.84 47.14,11.84 v47.18,11.8
A1
  Bottom 0.406: R28.2 19.86,33.94 17.26,33.94 14.67,31.35 J2.B8
A1O  (via drill 0.35 pad 0.7)
  Top 0.305: IC4.1 28.64,33.33 R13.1 29.24,33.66 30.08,32.82 30.81,32.82 v30.84,32.85
  Bottom 0.305: IC1.61 53.72,20.55 48.83,20.55 42.08,27.3 39.65,27.3 32.51,33.94 C5.2 30.84,33.84 | 30.84,33.84 v30.84,32.85 | C6.2 30.78,33.89 30.84,33.84
A2
  Bottom 0.406: J2.B9 18.21,23.43 18.7,23.92 18.7,25.63 20.4,27.32 20.4,29.39 R16.2
A2O  (via drill 0.35 pad 0.7)
  Top 0.305: IC7.1 29.23,29.26 R15.1 29.25,28.34 v29.19,28.16
  Bottom 0.305: IC1.60 53.68,19.71 48.76,19.71 41.79,26.68 35.36,26.68 32.44,29.09 C16.2 30.96,29.32 C17.2 29.18,29.18 v29.19,28.16
A3
  Bottom 0.406: J2.B10 18.9,20.43 19.71,21.24 19.71,24.12 R19.2
A3O  (via drill 0.35 pad 0.7)
  Top 0.305: IC8.1 27.76,24.72 R18.1 29.36,24.65 29.19,24.47 v29.19,23.46
  Bottom 0.305: IC1.59 53.71,18.94 48.44,18.94 41.53,25.85 35.27,25.85 34.16,24.73 C25.2 C26.2 29.16,23.5 v29.19,23.46
A4
  Bottom 0.406: J2.B11 18.82,17.43 20.75,19.36 20.75,20.5 R22.2
A4O  (via drill 0.35 pad 0.7)
  Top 0.305: IC9.1 27.74,20.13 R21.1 29.25,20.07 v29.25,19.06
  Bottom 0.305: C29.2 38.57,20.06 40.53,22.02 44.24,22.02 48.09,18.17 IC1.58 | C30.2 v29.25,19.06
  Bottom 0.406: C29.2 29.36,20.06 C30.2
A5
  Bottom 0.406: J2.B12 18.43,14.43 19.67,15.67 19.67,16.59 20.32,17.24 21.94,17.24 R25.2
A5O  (via drill 0.35 pad 0.7)
  Top 0.305: IC10.1 29.39,15.55 29.4,15.55 | 29.4,15.55 R24.1 29.42,14.46 v29.41,14.45 | 29.41,15.54 29.4,15.55
  Bottom 0.305: IC1.57 53.72,17.35 48.01,17.35 45.56,14.9 39.07,14.9 38.34,15.63 C33.2 31.14,15.65 C34.2 29.41,15.59 v29.41,14.45
A6
  Bottom 0.406: J2.B13 18.15,11.43 19.55,12.84 21.91,12.84 R29.2
A6O  (via drill 0.35 pad 0.7)
  Top 0.305: IC11.1 28.38,10.97 28.87,11.46 29.6,11.46 R27.1 30.21,11.45 30.6,11.06 32.72,11.06 v32.75,11.03
  Bottom 0.305: IC1.56 53.46,16.54 48.28,16.54 46.11,14.37 39,14.37 35.66,11.03 v32.75,11.03 32.34,11.03 31.48,11.89 31.57,11.97 | 32.2,12.12 C39.2 31.57,11.97 | C40.2 30.2,11.45 30.85,12.1 31.43,12.1 31.57,11.97
A7
  Bottom 0.406: J2.B18 11.95,14.43 13.22,13.16 13.22,9.37 15.32,7.27 18.34,7.27 19.79,8.21 21.83,8.21 R32.2
A7O  (via drill 0.35 pad 0.7)
  Top 0.305: R31.1 29.63,6.58 | R31.1 30.23,6.95 30.88,6.3 31.82,6.3 v31.94,6.18 | IC12.1 29,6.4 R31.1
  Bottom 0.305: IC1.55 48.37,15.76 46.39,13.78 39.26,13.78 32.62,7.14 31.89,7.14 C43.2 | C43.2 31.62,7.35 30.78,7.35 30.41,6.98 C44.2 | v31.94,6.18 31.94,7.09 C43.2
A8
  Bottom 0.406: J2.B19 11.67,8.77 16.82,3.88 21.73,3.88 R35.2
A8O  (via drill 0.35 pad 0.7)
  Top 0.305: 29.1,2.08 IC13.1 | 29.1,2.08 29.95,2.08 R34.1 30.16,2.25 | 29.1,2.08 v28.95,2.05
  Bottom 0.305: v28.95,2.05 29.95,2.03 C48.2 C47.2 32.15,2.21 33.85,3.91 33.85,7.45 39.45,13.05 47.69,13.05 R12.2
  Bottom 0.406: 31.74,2.25 C47.2 31.7,2.27
AGND  (via drill 0.35, 0.35 pad 0.65, 0.35 pad 0.7)
  Top 0.305: v32.7,8.42 32.59,8.42 R42.2 | R44.2 31.25,15.63 31.71,15.63 32.47,16.39 v32.47,16.53 33.01,17.07 IC15.HEATGND | R40.2 31.12,20.12 v32.17,21.16 | IC15.GND 40,17.07 v39.73,16.8 | R4.1 46.69,14.94 C9.2 46.28,14.55 v45.2,15.64 | IC17.1 36.31,4.61 v36.82,5.12 | IC17.4 37.34,2.18 v37.76,1.77 | v32.86,4.07 32.86,2.94 32.38,2.46 31.91,2.46 R41.2 | R39.2 31.12,24.7 v32.27,25.85 | v32.31,30.2 32.31,29.91 31.58,29.18 30.93,29.18 R38.2 | C13.1 52.16,10.36 v52.65,9.87 | 23.61,31.14 C15.2 23.57,31.44 v23.84,31.71 | v23.53,18.5 23.53,17.38 C32.2 | C36.2 23.43,13.23 v24.34,14.14 | v23.56,9.34 23.55,8.34 C42.2 | C46.2 23.42,4.75 v23.18,5.02 | v32.13,35.56 32.13,33.12 v32.09,32.82 30.95,33.96 R36.2 | R43.2 32.26,12.13 v33.05,12.92
  Top 0.406: C28.2 23.48,23.18 v23.53,23.22 | v23.62,27.49 23.62,26.45 C22.2 | IC6.5 41.63,11.8 v41.99,12.16 | IC16.P4 41.09,26.14 C37.2 42.54,25.3 43.37,24.47 43.37,23.15 v43.22,23 | R37.1 5.51,21.64 v7.34,19.82 | C4.2 23.04,33.95 v23.86,33.17
  Bottom 0.305: C10.2 40.63,20.93 v40.67,20.97 | IC1.63 53,22.16 v52.31,21.47 | C43.1 32.05,9.08 v32.7,8.42 | C33.1 31.68,17.33 v32.47,16.53 | v32.17,21.16 32.17,21.2 31.61,21.76 C29.1 | C69.1 39.91,3.02 R59.2 38.91,1.77 v37.76,1.77 | C47.1 32.7,3.91 v32.86,4.07 | v32.27,25.85 32.27,25.93 31.74,26.46 31.1,26.46 C25.1 | C16.1 31.72,30.79 v32.31,30.2 | v23.84,31.71 23.84,31.02 C14.2 | C31.2 23.62,18.41 v23.53,18.5 | v24.34,14.14 24.34,13.72 C35.2 | C41.2 23.58,9.28 v23.56,9.34 | v23.18,5.02 23.2,4.34 C45.2 | C5.1 31.83,35.63 32.08,35.38 32.08,35.35 v32.13,35.56 | v33.05,12.92 33.05,13.04 32.24,13.85 31.75,13.85 C39.1 | v36.82,5.12 36.63,4.93 36.62,4.93 35.82,4.12 C68.2
  Bottom 0.406: v23.53,23.22 23.53,22.09 C27.2 | C21.2 23.58,27.45 v23.62,27.49 | C38.2 35.32,21.5 v34.98,21.35 | v23.86,33.17 23.86,33.94 C3.2
  pour TopMiddle (isolate 0.254): 7.52,22.47 20.45,22.47 20.45,35.8 32.77,35.8 32.77,27.16 32.94,26.91 42.67,26.91 42.67,25.64 52.83,25.64 52.83,-0.34 6.48,-0.59 6.48,18.86 6.53,19.85 6.54,20.63 6.55,21.87 6.56,22.42
AVR_SCK  (via drill 0.35 pad 0.7)
  Top 0.305: J3.3 66.04,29.7 66.04,28.69 v63.5,26.15
  Bottom 0.305: v63.5,26.15 IC1.11
CAN_H
  Top 0.406: IC2.7 59.63,4.17 59.35,4.16 59.17,3.98 IC3.2 53.52,2.9 51.94,2.9 49.53,0.49 16.51,0.49 7.62,9.38 7.62,11.38 J2.B25
CAN_L
  Top 0.406: IC2.6 59.66,5.47 58.95,5.88 57.83,5.89 IC3.1 53.13,5.89 51.09,3.84 48.32,1.07 18.04,1.07 J2.B26
D+  (via drill 0.35 pad 0.7)
  Top 0.254: 81.71,26.23 IC5.15
  Top 0.305: IC5.15 83.11,26.23 v83.13,26.2
  Bottom 0.305: v83.13,26.2 83.13,22.81 82.2,21.88 82.2,19.62 83.44,18.38 84.84,18.38 J1.P$3
D-  (via drill 0.35 pad 0.7)
  Top 0.305: IC5.16 82.3,26.88 v82.57,27.15
  Bottom 0.305: v82.57,27.15 82.57,26.82 82.12,26.37 82.12,22.84 81.4,22.12 81.4,19.01 82.49,17.92 84.15,17.92 84.5,17.57 J1.P$2
DGND  (via drill 0.35, 0.35 pad 0.7)
  Top 0.305: v72.36,29.68 72.95,30.27 72.95,30.62 73.11,30.77 IC5.7 | IC5.18 79.88,28.17 v79.38,28.67 | C19.2 72.89,22.73 v73.03,22.59 | J3.6 55.93,34.28 v55.88,34.33 | IC3.3 57.95,4.91 v58.09,4.93 | C23.2 v34.76,34.45 v34.77,34.46 | IC5.26 IC5.25 v79.53,32.73 | IC5.21 82.39,30.12 v82.6,29.91
  Top 0.406: D5.1 13.17,35.59 v13.15,35.61 | IC14.1 44.41,33.67 v44.47,33.61 | LED4.C v48.12,35.39 v48.11,35.4 | C24.2 50.88,27.78 v50.88,27.7 | R37.2 5.52,24.3 v7.23,26.01 | IC2.2 v67.73,4.22
  Bottom 0.305: C18.2 77.63,26.63 v77.71,26.55 | C1.1 73.28,6.57 v73.33,6.53 | R3.2 61.59,6.36 v61.55,6.32 | C2.1 73.16,22.46 v73.03,22.59 | J1.P$5 84.86,21.38 v84.83,21.41 | IC1.53 55.9,14.16 v55.93,14.19 | SJ2.1 v66.35,32.26 | C7.2 v59.91,32.51 | IC1.22 70.41,18.96 v70.75,19.3
  pour TopMiddle (isolate 0.254): 6.73,23.35 19.1,23.35 19.43,23.59 19.43,36.69 33.66,36.69 33.66,27.93 43.43,27.93 43.43,26.66 53.35,26.66 53.85,26.22 53.85,-0.8 90.51,-0.74 90.65,5.56 90.68,36.87 88.88,38.67 6.88,38.67 6.38,38.17 6.38,23.74 6.4,23.46
DTR
  Top 0.305: C20.1 72.1,33.28 72.84,34.03 IC5.2
M8RXD
  Top 0.305: R2.1 73.39,35.29 IC5.1
M8TXD
  Top 0.305: R7.1 72.23,31.31 72.99,32.07 IC5.5
N$1
  Top 0.813: F3.2 15.05,30.05 J2.B1
N$2
  Top 0.508: IC15.ENABLE 44.63,19.61 R5.2 44.66,17.15 R4.2
N$5
  Bottom 0.305: R28.1 22.43,33.87 | R1.2 23.56,36 24.13,36.56 28.14,36.56 C6.1
  Bottom 0.406: R1.2 22.71,35.65 22.1,35.04 22.1,33.96 R28.1
N$6  (via drill 0.35 pad 0.7)
  Top 0.406: v62.86,2.95 IC2.8
  Bottom 0.406: R3.1 63.28,3.37 v62.86,2.95
N$9
  Top 0.508: LED4.A 48.12,29.96 R6.1
N$11
  Bottom 0.406: IC1.24 71.78,17.36 72.14,17 72.14,10.58 C1.2 76.65,9.76 Q1.1
N$17  (via drill 0.35 pad 0.7)
  Top 0.305: v26.44,35.2 27.7,35.2 IC4.3
  Bottom 0.305: 26.41,35.23 v26.44,35.2
  Bottom 0.406: v26.44,35.2 25.71,35.2 25.38,35.53 | 25.38,35.53 R1.1 | C3.1 25.28,35.43 25.38,35.53
N$18
  Bottom 0.406: IC1.54 53.72,14.95 52.62,14.95 51.69,14.02 R11.1 R12.1
N$19
  Top 0.305: IC4.4 25.11,35.65 25.5,36.05 28.82,36.05 R13.2 30.49,35.62 R36.1
N$20  (via drill 0.35 pad 0.7)
  Top 0.406: IC6.7 43.05,8.24 v43.69,8.88
  Bottom 0.406: v43.69,8.88 43.69,10.23 C8.1
N$21
  Top 0.406: IC6.2 50.59,8.24 C11.1
N$22
  Bottom 0.406: L1.2 IC1.64 | IC1.64
N$23  (via drill 0.35 pad 0.7)
  Top 0.406: IC6.1 46.61,6.97 46.23,7.35 46.23,7.86 v45.71,8.38
  Bottom 0.406: C8.2 45.55,8.53 v45.71,8.38
N$24
  Top 0.406: IC6.3 50.59,9.51 C11.2
N$25  (via drill 0.35 pad 0.7)
  Top 0.305: IC7.3 26.69,31.16 v26.42,30.89
  Bottom 0.305: 25.22,30.65 25.22,29.21 R14.1 | 25.22,30.65 C14.1 | v26.42,30.89 25.46,30.89 25.22,30.65
N$26
  Top 0.305: IC7.4 25.36,31.16 25.96,31.77 28.45,31.77 29.23,30.98 R15.2 R38.1
N$27
  Bottom 0.305: C17.1 29.26,31.02 26.92,28.69 26.91,28.69 26.54,28.32 24.41,28.32 R14.2 23.38,29.35 R16.1
N$28  (via drill 0.35 pad 0.7)
  Top 0.305: IC17.3 35.51,2.83 35.16,2.48 R58.2 34.75,2.13 v33.15,2.14
  Bottom 0.254: R59.1 33.76,2.74 v33.15,2.14
  Bottom 0.305: R59.1
N$29
  Top 0.305: IC17.6 41.03,2.84 41.49,2.38 41.49,2.35 41.64,2.2 41.7,2.13 43.93,2.13 44.05,2.25 C67.2 45.31,2.98 46.03,3.7 46.03,5.01 | 46.03,5.01 46.03,5.02 | 46.03,5.01 45.47,5.58 | 45.47,5.58 45.46,5.59 | 45.47,5.58 40.57,5.58 R60.2 40.53,5.43 41.15,4.81 41.81,4.81 R61.1
N$30  (via drill 0.35 pad 0.7)
  Top 0.305: v26.41,26.45 27.58,26.45 IC8.3
  Bottom 0.305: v26.41,26.45 26.4,26.44 C21.1 25.28,24.86 R17.1
N$31
  Top 0.305: 29.22,26.42 R18.2 | 29.22,26.42 28.45,27.2 25.71,27.2 IC8.4 | R39.1 29.24,26.4 29.22,26.42
N$32  (via drill 0.35 pad 0.7)
  Top 0.305: v79.41,31.42 IC5.23
  Bottom 0.305: LED2.C 78.02,32.82 v79.41,31.42
N$33
  Bottom 0.305: R19.1 23.49,24.75 R17.2 24.39,24.04 25.96,24.04 26.04,24.12 26.92,24.12 29.16,26.35 C26.1
N$34
  Top 0.305: IC5.22 83.36,30.77 LED3.C
N$35
  Bottom 0.305: LED2.A 75.92,31.08 R8.1
N$36
  Top 0.305: LED3.A 83.88,25.71 82.2,24.04 78.67,24.04 R9.1
N$37  (via drill 0.35 pad 0.7)
  Top 0.305: IC9.3 26.52,22.02 v26.5,22
  Bottom 0.305: 25.4,22 v26.5,22 | 25.4,22 25.32,22 C27.1 | R20.1 25.23,21.82 25.4,22
N$38
  Top 0.305: IC9.4 25.91,22.82 28.47,22.82 29.32,21.97 R21.2 29.33,21.82 R40.1
N$39
  Bottom 0.305: 23.48,20.21 R22.1 | 23.48,20.21 R20.2 | C30.1 29.01,21.88 27.95,20.81 27.95,19.83 27.43,19.32 24.38,19.32 23.48,20.21
N$40  (via drill 0.35 pad 0.7)
  Top 0.305: IC10.3 26.45,17.45 v26.43,17.43
  Bottom 0.305: 25.4,17.43 v26.43,17.43 | 25.4,17.43 25.34,17.43 C31.1 | R23.1 25.25,17.28 25.4,17.43
N$41
  Top 0.305: IC10.4 25.11,17.64 25.77,18.3 28.39,18.3 29.25,17.45 29.41,17.28 | 29.41,17.28 R24.2 | R44.1 29.41,17.28
N$42
  Bottom 0.305: R25.1 22.17,15.77 R23.2 24.36,14.96 25.93,14.96 25.94,14.97 26.92,14.97 29.3,17.35 C34.1
N$43  (via drill 0.35 pad 0.7)
  Top 0.305: IC11.3 26.48,12.87 v26.41,12.83
  Bottom 0.305: R26.1 25.21,12.89 C35.1 | 25.26,12.94 C35.1 | C35.1 26.33,12.91 v26.41,12.83
N$44
  Top 0.305: IC11.4 25.11,13.08 25.62,13.58 29.01,13.58 R27.2 | 29.85,13.4 R27.2 | R27.2 30.18,13.15 30.79,13.76 31.45,13.76 R43.1
N$45
  Bottom 0.305: R26.2 23.55,11.15 24.45,10.25 26.88,10.25 C40.1
  Bottom 0.406: R29.1 23.5,11.16 R26.2
N$46  (via drill 0.35 pad 0.7)
  Top 0.305: v26.42,8.27 27.68,8.27 IC12.3
  Bottom 0.305: R30.1 25.34,8.25 C41.1 26.38,8.3 v26.42,8.27
N$47
  Top 0.305: R42.1 31.12,8.65 R31.2 28.99,8.65 28.62,9.02 25.83,9.02 IC12.4
N$48
  Bottom 0.305: R32.1 23.63,6.56 R30.2 23.68,6.55 24.48,5.74 26.42,5.74 27.71,5.74 28.68,6.71 28.68,8.13 29.18,8.63 29.75,8.63 C44.1
N$49  (via drill 0.35 pad 0.7)
  Top 0.305: IC13.3 26.86,3.98 v26.4,3.52
  Bottom 0.305: R33.1 25.24,3.98 C45.1 25.72,3.52 v26.4,3.52
N$50
  Top 0.305: R41.1 R34.2 29.49,4.62 26.4,4.62 25.77,3.98 IC13.4
N$51
  Bottom 0.305: R35.1 R33.2 23.54,1.87 24.05,1.37 27.08,1.37 28.95,3.24 29.45,3.24 C48.1
RESET  (via drill 0.35 pad 0.7)
  Top 0.406: C20.2 69.72,33.26 v68.07,33.26 66.55,33.26 65.53,34.28 J3.5
  Bottom 0.305: D3.A 61.61,33.3 C7.1 63.98,31.23 SJ2.2
  Bottom 0.406: D3.A 67.91,33.43 v68.07,33.26 68.07,30.72 70.61,28.18 70.61,21.07 70.1,20.56 IC1.20 | R10.1 57.91,31.23 58.93,30.21 60.59,30.21 C7.1
RX  (via drill 0.35 pad 0.7)
  Top 0.305: J3.4 | R2.2 61.47,35.29 J3.4 | J3.4 55.65,31.74 v54.1,30.19
  Bottom 0.305: v54.1,30.19 54.1,28.26 56.32,26.04 56.32,24.75 IC1.2
RXCAN  (via drill 0.35 pad 0.7)
  Top 0.406: v66.04,11.42 66.04,6.97 IC2.4
  Bottom 0.406: IC1.31 66.39,11.76 v66.04,11.42
SG  (via drill 0.35 pad 0.7)
  Top 0.305: IC17.2 36.41,3.58 37.27,3.58 37.65,3.96 37.65,5.35 37,6 v36.42,6
  Top 0.406: J2.B3 17.5,21.93 19.26,20.17 19.26,11.53 v20.64,10.15 | v34.56,10.06 34.56,9.71 v36.51,7.76
  Bottom 0.406: v20.64,10.15 23.8,10.15 24.36,9.59 27.26,9.58 28.07,10.44 28.31,10.45 28.29,10.45 30.55,10.45 30.84,10.17 34.45,10.17 v34.56,10.06 | v36.51,7.76 36.51,6.09 v36.42,6
SG5V  (via drill 0.35, 0.35 pad 0.7)
  Top 0.508: IC15.VOUT 42.36,15.82 v40.59,15.82 40.59,12.98 39.49,11.88 v39.47,11.88 | v34.76,5.44 R58.1
  Bottom 0.508: C10.1 40.63,15.86 v40.59,15.82 | v39.47,11.88 36.02,8.43 36.01,8.43 34.79,7.21 34.79,5.47 v34.76,5.44
SGO  (via drill 0.35 pad 0.7)
  Top 0.254: R61.2 43.73,4.27 43.22,3.76 43.22,3.27 42.9,2.96 42.35,2.96 42.34,2.97
  Top 0.305: IC17.7 41.27,3.48 41.79,2.97 42.34,2.97 C67.1
  Top 0.406: R61.2 45.17,4.27 v45.21,4.3
  Bottom 0.406: v45.21,4.3 45.21,3.05 C69.2 45.58,3.02 51.53,8.97 51.53,11.94 R11.2
TX  (via drill 0.35 pad 0.7)
  Top 0.305: R7.2 69.71,31.18 v65.68,27.15 | J3.1 64.01,28.11 v63.05,27.15
  Bottom 0.305: v65.68,27.15 v63.05,27.15 58.4,27.15 57.13,25.88 57.13,24.76 IC1.3
TXCAN  (via drill 0.35 pad 0.7)
  Top 0.406: v64.01,12.43 64.01,3.32 64.34,2.99 65.79,2.99 IC2.1
  Bottom 0.406: IC1.30 64.14,12.56 v64.01,12.43
VCC  (via drill 0.35 pad 0.7)
  Top 0.305: 81.25,29.46 IC5.20 | 81.25,29.46 IC5.19 | R9.2 74.81,24.06 C19.1 74.79,22.72 v74.84,22.67 | IC2.3 67.8,5.49 v67.88,5.57 | IC17.8 39.3,4.14 v39.06,4.37 | IC5.4 76.84,32.73 v79.33,30.23 80.15,29.42 81.22,29.42 81.25,29.46 | J3.2 55.84,29.2 v55.76,29.28
  Top 0.406: v42.09,32.37 42.11,32.35 IC14.4 40.13,29.93 v39.57,30.49 | IC14.2 41.87,34.26 v40.61,33 | C24.1 44.76,27.78 v44.6,27.94
  Top 0.508: IC14.4 46.19,29.93 R6.2 46.2,27.8 C24.1 | IC6.6 41.61,9.49 40.35,9.49 40.06,9.2 C12.2 39.48,10.43 v39.5,10.45
  Bottom 0.305: L1.1 48.16,22.96 v47.45,23.67 | IC1.21 67.78,19.76 v67.77,19.75 | J1.P$1 v84.86,15.34 v84.85,15.33 | IC1.52 57.27,13.36 v57.31,13.4 | v39.06,4.37 37.73,4.37 C68.1 | 55.76,31.22 v55.76,29.28 | 55.76,31.22 R10.2 | D3.C 56.83,33.43 55.76,32.36 55.76,31.22 | R8.2 78.6,30.97 v79.33,30.23
  pour BottomMiddle (isolate 0.254): 7.62,38.59 88.9,38.34 90.42,36.82 90.42,1.26 88.39,-0.78 7.11,-0.78 6.4,-0.53 6.4,37.06
VCC3O  (via drill 0.35 pad 0.7)
  Top 0.305: v78.7,27.51 81.24,27.51 IC5.17
  Bottom 0.305: C18.1 77.69,28.53 v78.7,27.51
XTAL1
  Bottom 0.406: IC1.23 71.9,18.16 C2.2 76.66,19.42 Q1.2

### Text on the board
tNames: 2018 CAN Board - Analog